# EAGLE design das.uhr (EAGLE 6.3)
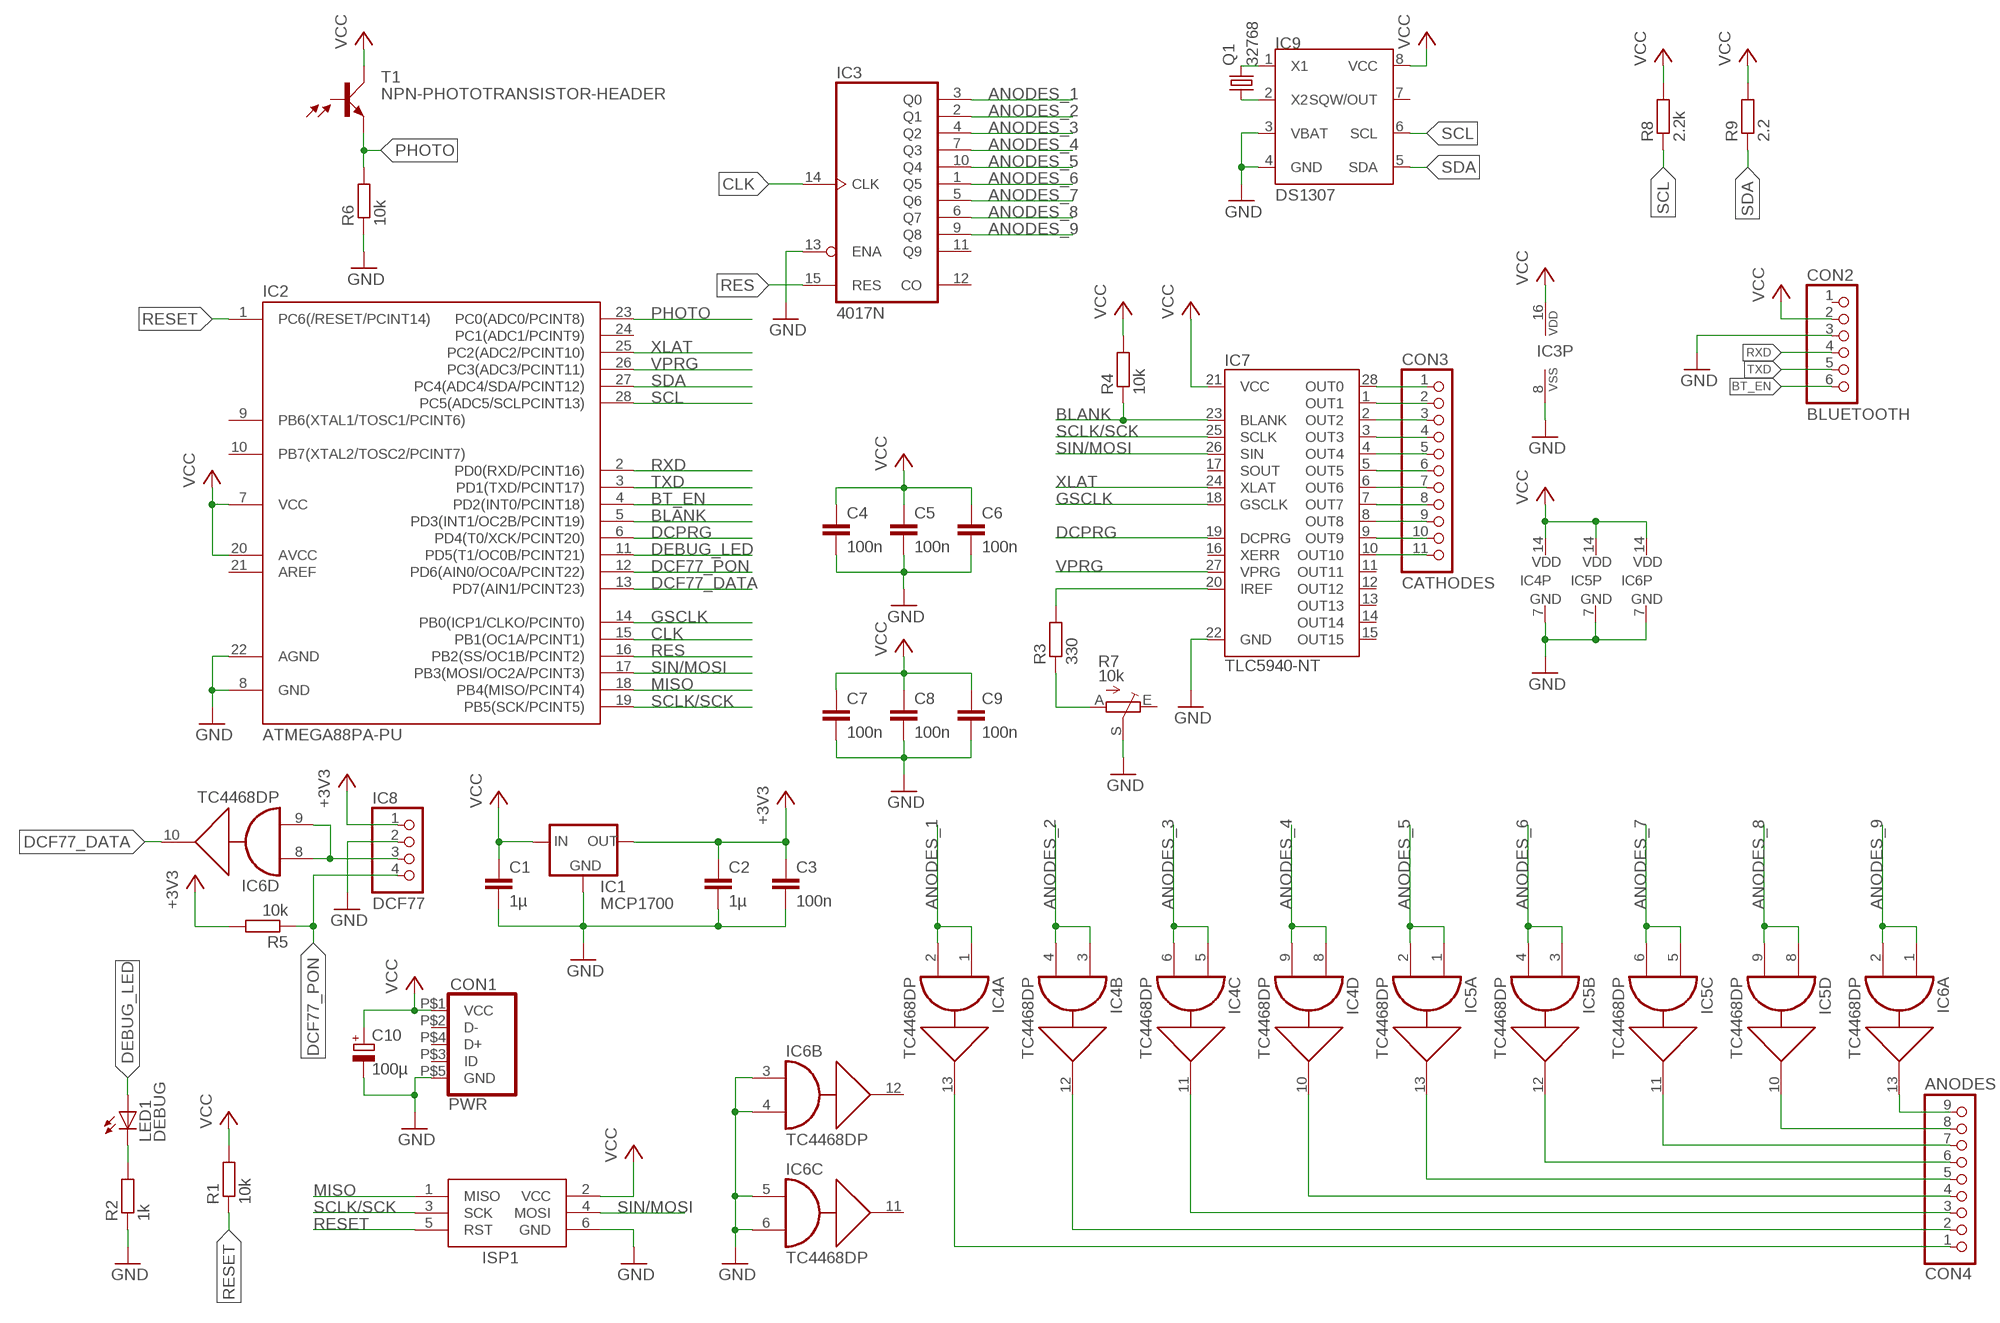
[diagram p0: schematic, sheet 1]

## Parts
C1  1µ  C050-024X044  [C050-024X044]
C2  1µ  C050-024X044  [C050-024X044]
C3  100n  C050-024X044  [C050-024X044]
C4  100n  C050-024X044  [C050-024X044]
C5  100n  C050-024X044  [C050-024X044]
C6  100n  C050-024X044  [C050-024X044]
C7  100n  C050-024X044  [C050-024X044]
C8  100n  C050-024X044  [C050-024X044]
C9  100n  C050-024X044  [C050-024X044]
C10  100µ  CPOL-EUE2.5-5  [E2,5-5]
CON1  PWR  USB-RECEPTABLE-HIROSE-ZX62-AB-5PA(11)  [HIROSE-ZX62-AB-5PA(11)]
CON2  BLUETOOTH  PINHD-1X6  [1X06]
CON3  CATHODES  PINHD-1X11  [1X11]
CON4  ANODES  PINHD-1X9  [1X09]
IC1  MCP1700  MCP1700INLINE  [TO92-INLINE]
IC2  ATMEGA88PA-PU  MEGA48/88/168-PU  [DIL28-3]
IC3  4017N  [DIL16]
IC4  TC4468DP  [DIL14]
IC5  TC4468DP  [DIL14]
IC6  TC4468DP  [DIL14]
IC7  TLC5940-NT  [DIL28-3]
IC8  DCF77  PINHD-1X4  [1X04]
IC9  DS1307  [DIL08]
ISP1  AVRISP-6  [AVRISP]
LED1  DEBUG  LED3MM  [LED3MM]
Q1  32768  CRYSTALTC26V  [TC26V]
R1  10k  R-EU_0207/7  [0207/7]
R2  1k  R-EU_0207/7  [0207/7]
R3  330  R-EU_0207/7  [0207/7]
R4  10k  R-EU_0207/7  [0207/7]
R5  10k  R-EU_0207/7  [0207/7]
R6  10k  R-EU_0207/7  [0207/7]
R7  10k  TRIM_EU-S63P  [S63P]
R8  2.2k  R-EU_0207/7  [0207/7]
R9  2.2  R-EU_0207/7  [0207/7]
T1  NPN-PHOTOTRANSISTOR-HEADER  [1X02-S]

## Nets
+3V3: C2.1 C3.1 IC1.3(OUT) IC8.1 R5.2
ANODES_1: IC3.3(Q0) IC4.1(A:A) IC4.2(A:B)
ANODES_2: IC3.2(Q1) IC4.3(B:A) IC4.4(B:B)
ANODES_3: IC3.4(Q2) IC4.5(C:A) IC4.6(C:B)
ANODES_4: IC3.7(Q3) IC4.8(D:A) IC4.9(D:B)
ANODES_5: IC3.10(Q4) IC5.1(A:A) IC5.2(A:B)
ANODES_6: IC3.1(Q5) IC5.3(B:A) IC5.4(B:B)
ANODES_7: IC3.5(Q6) IC5.5(C:A) IC5.6(C:B)
ANODES_8: IC3.6(Q7) IC5.8(D:A) IC5.9(D:B)
ANODES_9: IC3.9(Q8) IC6.1(A:A) IC6.2(A:B)
BLANK: IC2.5(PD3(INT1/OC2B/PCINT19)) IC7.23(BLANK) R4.1
BT_EN: CON2.6 IC2.4(PD2(INT0/PCINT18))
CLK: IC2.15(PB1(OC1A/PCINT1)) IC3.14(CLK)
DCF77_DATA: IC2.13(PD7(AIN1/PCINT23)) IC6.10(D:Y)
DCF77_PON: IC2.12(PD6(AIN0/OC0A/PCINT22)) IC8.4 R5.1
DCPRG: IC2.6(PD4(T0/XCK/PCINT20)) IC7.19(DCPRG)
DEBUG_LED: IC2.11(PD5(T1/OC0B/PCINT21)) LED1.A
GND: C1.2 C2.2 C3.2 C4.2 C5.2 C6.2 C7.2 C8.2 C9.2 C10.- CON1.P$5(GND) CON2.3 IC1.1(GND) IC2.8(GND) IC2.22(AGND) IC3.8(VSS) IC3.13(ENA) IC4.7(P:GND) IC5.7(P:GND) IC6.3(B:A) IC6.4(B:B) IC6.5(C:A) IC6.6(C:B) IC6.7(P:GND) IC7.22(GND) IC8.2 IC9.3(VBAT) IC9.4(GND) ISP1.6(GND) R2.1 R6.1 R7.S
GSCLK: IC2.14(PB0(ICP1/CLKO/PCINT0)) IC7.18(GSCLK)
MISO: IC2.18(PB4(MISO/PCINT4)) ISP1.1(MISO)
N$1: LED1.K(C) R2.2
N$3: CON3.1 IC7.28(OUT0)
N$4: CON3.2 IC7.1(OUT1)
N$5: CON3.3 IC7.2(OUT2)
N$6: CON3.4 IC7.3(OUT3)
N$7: CON3.5 IC7.4(OUT4)
N$8: CON3.6 IC7.5(OUT5)
N$9: CON3.7 IC7.6(OUT6)
N$10: CON3.8 IC7.7(OUT7)
N$11: CON3.9 IC7.8(OUT8)
N$13: CON3.10 IC7.9(OUT9)
N$14: CON3.11 IC7.10(OUT10)
N$15: IC7.20(IREF) R3.2
N$16: CON4.9 IC6.13(A:Y)
N$17: CON4.8 IC5.10(D:Y)
N$18: CON4.7 IC5.11(C:Y)
N$19: CON4.6 IC5.12(B:Y)
N$20: CON4.5 IC5.13(A:Y)
N$21: CON4.4 IC4.10(D:Y)
N$22: CON4.3 IC4.11(C:Y)
N$23: CON4.2 IC4.12(B:Y)
N$24: CON4.1 IC4.13(A:Y)
N$25: IC6.8(D:A) IC6.9(D:B) IC8.3
N$26: R3.1 R7.A
N$27: IC9.1(X1) Q1.2
N$28: IC9.2(X2) Q1.1
PHOTO: IC2.23(PC0(ADC0/PCINT8)) R6.2 T1.2(E)
RES: IC2.16(PB2(SS/OC1B/PCINT2)) IC3.15(RES)
RESET: IC2.1(PC6(/RESET/PCINT14)) ISP1.5(RST) R1.1
RXD: CON2.4 IC2.2(PD0(RXD/PCINT16))
SCL: IC2.28(PC5(ADC5/SCLPCINT13)) IC9.6(SCL) R8.1
SCLK/SCK: IC2.19(PB5(SCK/PCINT5)) IC7.25(SCLK) ISP1.3(SCK)
SDA: IC2.27(PC4(ADC4/SDA/PCINT12)) IC9.5(SDA) R9.1
SIN/MOSI: IC2.17(PB3(MOSI/OC2A/PCINT3)) IC7.26(SIN) ISP1.4(MOSI)
TXD: CON2.5 IC2.3(PD1(TXD/PCINT17))
VCC: C1.1 C4.1 C5.1 C6.1 C7.1 C8.1 C9.1 C10.+ CON1.P$1(VCC) CON2.2 IC1.2(IN) IC2.7(VCC) IC2.20(AVCC) IC3.16(VDD) IC4.14(P:VDD) IC5.14(P:VDD) IC6.14(P:VDD) IC7.21(VCC) IC9.8(VCC) ISP1.2(VCC) R1.2 R4.2 R8.2 R9.2 T1.1(C)
VPRG: IC2.26(PC3(ADC3/PCINT11)) IC7.27(VPRG)
XLAT: IC2.25(PC2(ADC2/PCINT10)) IC7.24(XLAT)
Unconnected: CON1.P$2(D-) CON1.P$3(ID) CON1.P$4(D+) CON2.1 IC2.9(PB6(XTAL1/TOSC1/PCINT6)) IC2.10(PB7(XTAL2/TOSC2/PCINT7)) IC2.21(AREF) IC2.24(PC1(ADC1/PCINT9)) IC3.11(Q9) IC3.12(CO) IC6.11(C:Y) IC6.12(B:Y) IC7.11(OUT11) IC7.12(OUT12) IC7.13(OUT13) IC7.14(OUT14) IC7.15(OUT15) IC7.16(XERR) IC7.17(SOUT) IC9.7(SQW/OUT) R7.E

## Library data of the parts
C1-C9 = daspilker:C: CAPACITOR
C10 = rcl:CPOL-EU: POLARIZED CAPACITOR, European symbol
CON1 = daspilker:USB-RECEPTABLE: USB Receptable
CON2 = pinhead:PINHD-1X6: PIN HEADER
CON3 = pinhead:PINHD-1X11: PIN HEADER
CON4 = pinhead:PINHD-1X9: PIN HEADER
IC1 = adafruit:MCP1700: VOLTAGE REGULATOR
IC2 = daspilker:MEGA48/88/168-PU
IC3 = 40xx:4017: COUNTER/DIVIDER
IC4-IC6 = microchip:TC4468: Logic-Input CMOS Quad Drivers Source: TC 4469-MOSFET-DRIVER.pdf; MF: MICROCHIP; MPN: TC4468CPD; OC_FARNELL: 1557406; OC_NEWARK: 54K2859
IC7 = daspilker:TLC5940: TI TLC5940 16-channel LED Driver with Dot Correction and Grayscale PWM Control The TLC5940 is a 16-channel, constant-current sink LED driver. Each channel has an individually adjustable 4096-step grayscale PWM brightness control and a 64-step, constant-current sink (dot correction). The dot correction adjusts the brightness variations between LED channels and other LED drivers. The dot correction data is stored in an integrated EEPROM. Both grayscale control and dot correction are accessible via a serial interface. A single external resistor sets the maximum current value of all 16 channels. Packages: 28-pin HTSSOP 32-pin 5x5mm QFN 28-pin DIP
IC8 = pinhead:PINHD-1X4: PIN HEADER
IC9 = daspilker:DS1307: I2C Serial RTC w/56 bytes battery backed RAM
ISP1 = adafruit:AVRISP: AVR ISP HEADER Standard 6 pin header for AVR programming
LED1 = led:LED: LED OSRAM: - CHIPLED LG R971, LG N971, LY N971, LG Q971, LY Q971, LO R971, LY R971 LH N974, LH R974 LS Q976, LO Q976, LY Q976 LO Q996 - Hyper CHIPLED LW Q18S LB Q993, LB Q99A, LB R99A - SideLED LS A670, LO A670, LY A670, LG A670, LP A670 LB A673, LV A673, LT A673, LW A673 LH A674 LY A675 LS A676, LA A676, LO A676, LY A676, LW A676 LS A679, LY A679, LG A679 - Hyper Micro SIDELED® LS Y876, LA Y876, LO Y876, LY Y876 LT Y87S - SmartLED LW L88C, LW L88S LB L89C, LB L89S, LG L890 LS L89K, LO L89K, LY L89K LS L896, LA L896, LO L896, LY L896 - TOPLED LS T670, LO T670, LY T670, LG T670, LP T670 LSG T670, LSP T670, LSY T670, LOP T670, LYG T670 LG T671, LOG T671, LSG T671 LB T673, LV T673, LT T673, LW T673 LH T674 LS T676, LA T676, LO T676, LY T676, LB T676, LH T676, LSB T676, LW T676 LB T67C, LV T67C, LT T67C, LS T67K, LO T67K, LY T67K, LW E67C LS E67B, LA E67B, LO E67B, LY E67B, LB E67C, LV E67C, LT E67C LW T67C LS T679, LY T679, LG T679 LS T770, LO T770, LY T770, LG T770, LP T770 LB T773, LV T773, LT T773, LW T773 LH T774 LS E675, LA E675, LY E675, LS T675 LS T776, LA T776, LO T776, LY T776, LB T776 LHGB T686 LT T68C, LB T68C - Hyper Mini TOPLED® LB M676 - Mini TOPLED Santana® LG M470 LS M47K, LO M47K, LY M47K Source: http://www.osram.convergy.de LUXEON: - LUMILED® LXK2-PW12-R00, LXK2-PW12-S00, LXK2-PW14-U00, LXK2-PW14-V00 LXK2-PM12-R00, LXK2-PM12-S00, LXK2-PM14-U00 LXK2-PE12-Q00, LXK2-PE12-R00, LXK2-PE12-S00, LXK2-PE14-T00, LXK2-PE14-U00 LXK2-PB12-K00, LXK2-PB12-L00, LXK2-PB12-M00, LXK2-PB14-N00, LXK2-PB14-P00, LXK2-PB14-Q00 LXK2-PR12-L00, LXK2-PR12-M00, LXK2-PR14-Q00, LXK2-PR14-R00 LXK2-PD12-Q00, LXK2-PD12-R00, LXK2-PD12-S00 LXK2-PH12-R00, LXK2-PH12-S00 LXK2-PL12-P00, LXK2-PL12-Q00, LXK2-PL12-R00 Source: www.luxeon.com KINGBRIGHT: KA-3528ASYC Source: www.kingbright.com
Q1 = crystal:CRYSTAL: CRYSTAL; OC_FARNELL: unknown; OC_NEWARK: unknown
R1-R6 R8 R9 = rcl:R-EU_: RESISTOR, European symbol
R7 = pot:TRIM_EU-: POTENTIOMETER
T1 = daspilker:NPN-PHOTOTRANSISTOR: NPN phototransistor

## Board
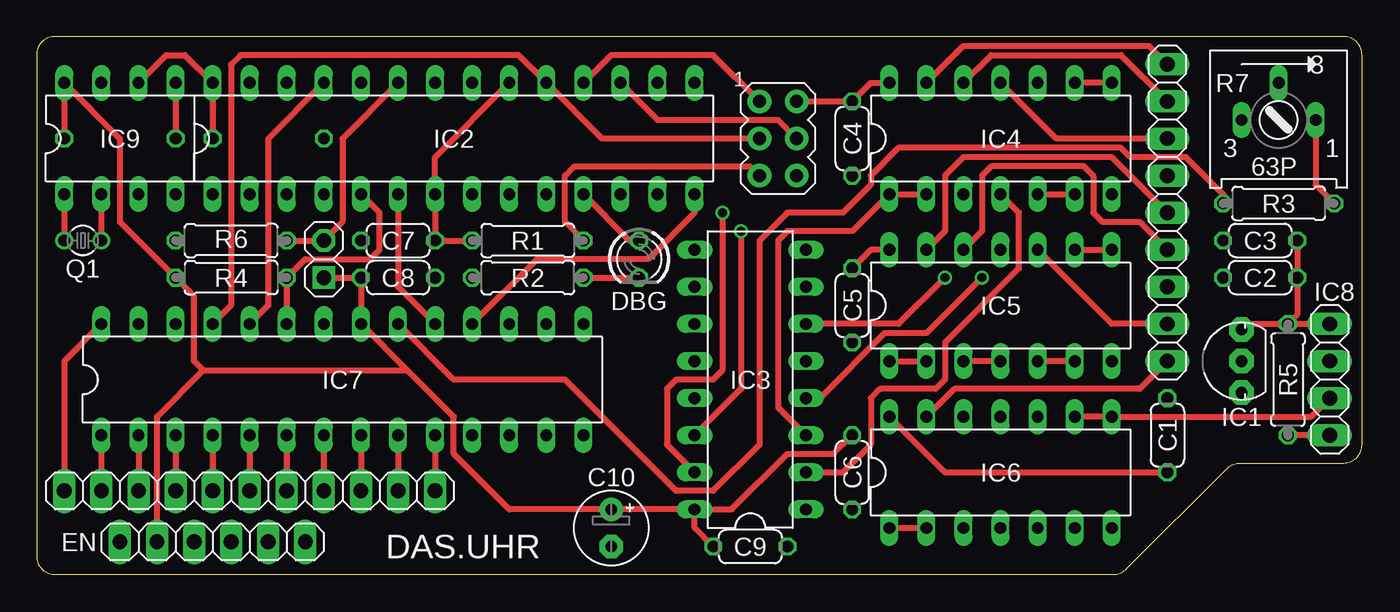
[diagram p1: board, top side]
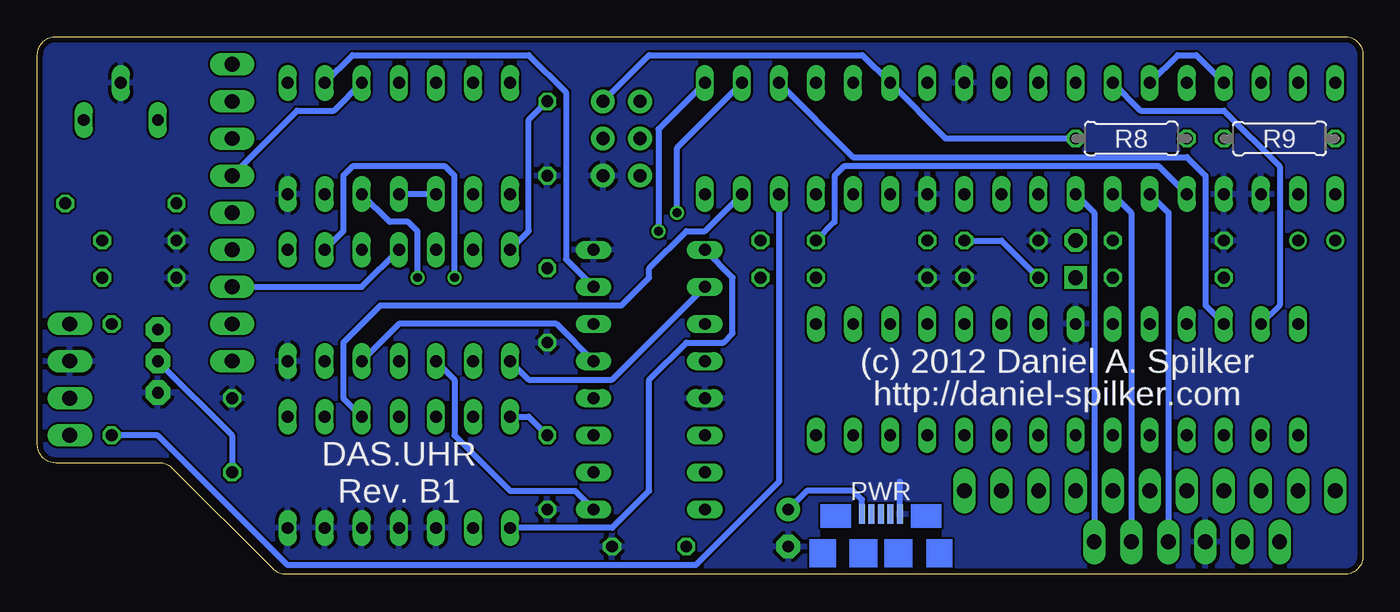
[diagram p2: board, bottom side, seen from below]

Size 90.81 x 36.83 mm. Coordinates in mm from the lower left corner, seen from the top.
Outline: 1.27,0 73.77,0 arc45 74.67,0.37 81.54,7.25 arc-45 82.44,7.62 89.53,7.62 arc90 90.81,8.89 90.81,35.56 arc90 89.53,36.83 1.27,36.83 arc90 0,35.56 0,1.27 arc90 1.27,0
Copper layers (1*16): Top 0.0356mm / dielectric 1.5011mm / Bottom 0.0356mm
Design rules "LaenPCBOrder": minimum track width 6mil, minimum drill 13mil, track to track 6mil, track to pad 6mil, pad to pad 6mil, via to via 6mil, smd to smd 6mil, copper to edge 15mil, drill to drill 6mil, minimum pad ring 7mil, minimum via ring 7mil, stop-mask expansion 4mil, vias tented up to drill 0mil, thermal gap 10mil

### Footprints (pad centres in the part's own frame; a part is rotated, then mirrored left to right if it is on the bottom)
C050-024X044 = drill 0.813 octagon: 1 -2.54,0; 2 2.54,0
E2,5-5 = drill 0.813 pad 1.6: + -1.27,0 | drill 0.813 pad 1.6 octagon: - 1.27,0
HIROSE-ZX62-AB-5PA(11) = smd 0.4 x 1.35 bottom: P$1 1.3,4.125; P$2 0.65,4.125; P$3 0,4.125; P$4 -0.65,4.125; P$5 -1.3,4.125
1X06 = drill 1.016 long: 1 -6.35,0; 2 -3.81,0; 3 -1.27,0; 4 1.27,0; 5 3.81,0; 6 6.35,0
1X11 = drill 1.016 long: 1 -12.7,0; 2 -10.16,0; 3 -7.62,0; 4 -5.08,0; 5 -2.54,0; 6 0,0; 7 2.54,0; 8 5.08,0; 9 7.62,0; 10 10.16,0; 11 12.7,0
1X09 = drill 1.016 long: 1 -10.16,0; 2 -7.62,0; 3 -5.08,0; 4 -2.54,0; 5 0,0; 6 2.54,0; 7 5.08,0; 8 7.62,0; 9 10.16,0
TO92-INLINE = drill 0.813 pad 1.676 octagon: 1 -2.159,0; 2 0,0; 3 2.159,0
DIL28-3 = drill 0.813 long: 1 -16.51,-3.81; 2 -13.97,-3.81; 3 -11.43,-3.81; 4 -8.89,-3.81; 5 -6.35,-3.81; 6 -3.81,-3.81; 7 -1.27,-3.81; 8 1.27,-3.81; 9 3.81,-3.81; 10 6.35,-3.81; 11 8.89,-3.81; 12 11.43,-3.81; 13 13.97,-3.81; 14 16.51,-3.81; 15 16.51,3.81; 16 13.97,3.81; 17 11.43,3.81; 18 8.89,3.81; 19 6.35,3.81; 20 3.81,3.81; 21 1.27,3.81; 22 -1.27,3.81; 23 -3.81,3.81; 24 -6.35,3.81; 25 -8.89,3.81; 26 -11.43,3.81; 27 -13.97,3.81; 28 -16.51,3.81
DIL16 = drill 0.813 long: 1 -8.89,-3.81; 2 -6.35,-3.81; 3 -3.81,-3.81; 4 -1.27,-3.81; 5 1.27,-3.81; 6 3.81,-3.81; 7 6.35,-3.81; 8 8.89,-3.81; 9 8.89,3.81; 10 6.35,3.81; 11 3.81,3.81; 12 1.27,3.81; 13 -1.27,3.81; 14 -3.81,3.81; 15 -6.35,3.81; 16 -8.89,3.81
DIL14 = drill 0.813 long: 1 -7.62,-3.81; 2 -5.08,-3.81; 3 -2.54,-3.81; 4 0,-3.81; 5 2.54,-3.81; 6 5.08,-3.81; 7 7.62,-3.81; 8 7.62,3.81; 9 5.08,3.81; 10 2.54,3.81; 11 0,3.81; 12 -2.54,3.81; 13 -5.08,3.81; 14 -7.62,3.81
1X04 = drill 1.016 long: 1 -3.81,0; 2 -1.27,0; 3 1.27,0; 4 3.81,0
DIL08 = drill 0.813 long: 1 -3.81,-3.81; 2 -1.27,-3.81; 3 1.27,-3.81; 4 3.81,-3.81; 5 3.81,3.81; 6 1.27,3.81; 7 -1.27,3.81; 8 -3.81,3.81
AVRISP = drill 0.9 pad 1.626: 1 -1.27,2.54; 2 1.27,2.54; 3 -1.27,0; 4 1.27,0; 5 -1.27,-2.54; 6 1.27,-2.54
LED3MM = drill 0.813 octagon: A -1.27,0; K 1.27,0
TC26V = drill 0.813: 1 -1.27,0; 2 1.27,0
0207/7 = drill 0.813 octagon: 1 -3.81,0; 2 3.81,0
S63P = drill 0.813 long: A 2.54,0; E -2.54,0; S 0,2.54
1X02-S = drill 1.016 square: 1 -1.27,0 | drill 1.016 octagon: 2 1.27,0

### Placement (x,y rotation side)
C1  77.47,9.53 90 top
C2  83.82,20.32 180 top
C3  83.82,22.86 180 top
C4  55.88,29.84 270 top
C5  55.88,18.41 270 top
C6  55.88,6.99 270 top
C7  24.77,22.86 180 top
C8  24.77,20.32 0 top
C9  48.9,1.91 0 top
C10  39.37,3.17 270 top
CON1  33.02,0 0 top
CON2  12.06,2.22 0 top
CON3  14.61,5.71 0 top
CON4  77.47,24.77 270 top
IC1  82.55,14.61 90 top
IC2  28.57,29.84 0 top
IC3  48.9,13.34 90 top
IC4  66.04,29.84 0 top
IC5  66.04,18.41 0 top
IC6  66.04,6.99 0 top
IC7  20.95,13.34 0 top
IC8  88.58,13.34 270 top
IC9  5.71,29.84 0 top
ISP1  50.8,29.84 0 top
LED1  41.27,21.59 270 top
Q1  3.17,22.86 180 top
R1  33.66,22.86 180 top
R2  33.66,20.32 0 top
R3  85.09,25.4 180 top
R4  13.34,20.32 180 top
R5  85.72,13.34 90 top
R6  13.34,22.86 0 top
R7  85.09,31.11 0 top
R8  15.88,29.84 180 bottom
R9  5.71,29.84 0 bottom
T1  19.68,21.59 90 top

### Tracks (layer width: path | path; a pad name or v marks a point on that pad's centre or on a via)
+3V3
  Top 0.406: R5.2 IC8.1 | C3.1 C2.1 86.36,17.78 R5.2 | IC1.3 82.93,17.14 R5.2
ANODES_1
  Top 0.406: IC4.2 IC4.1 55.88,23.5 51.44,23.5 50.8,22.86 50.8,11.43 IC3.3
ANODES_2
  Top 0.406: IC3.2 55.24,6.99 57.15,8.89 57.15,12.06 57.78,12.7 61.59,12.7 62.23,13.34 62.23,15.88 67.31,20.95 67.31,24.77 IC4.4
  Bottom 0.406: IC4.3 IC4.4
ANODES_3  (via drill 0.6)
  Top 0.406: IC4.5 IC4.6 | v64.77,20.32 60.96,16.51 58.1,16.51 53.66,12.06 IC3.4
  Bottom 0.406: v64.77,20.32 64.77,23.5 65.41,24.13 66.67,24.13 IC4.5
ANODES_4
  Top 0.406: IC4.8 IC4.9
  Bottom 0.406: IC4.9 69.22,35.56 57.15,35.56 54.61,33.02 54.61,21.59 IC3.7
ANODES_5
  Top 0.406: IC5.1 IC5.2
  Bottom 0.406: IC5.1 57.15,13.34 51.44,13.34 IC3.10
ANODES_6
  Top 0.406: IC5.4 IC5.3
  Bottom 0.406: IC3.1 53.98,5.71 58.42,5.71 62.23,9.53 62.23,13.34 IC5.3
ANODES_7
  Top 0.406: IC5.6 IC5.5
  Bottom 0.406: IC3.5 55.24,17.14 66.04,17.14 IC5.5
ANODES_8  (via drill 0.6)
  Top 0.406: IC5.9 IC5.8 | v62.23,20.32 59.05,17.14 IC3.6
  Bottom 0.406: v62.23,20.32 62.23,27.3 62.87,27.94 69.22,27.94 69.85,27.3 69.85,23.5 IC5.9
ANODES_9
  Top 0.406: IC6.1 IC6.2
  Bottom 0.406: IC3.9 43.18,20.32 43.18,16.51 43.81,15.88 46.35,15.88 48.9,13.34 48.9,5.71 51.44,3.17 IC6.1
BLANK
  Top 0.406: IC2.5 23.5,24.77 23.5,22.23 22.86,21.59 18.41,21.59 R4.1 IC7.23
BT_EN
  Bottom 0.406: IC2.4 18.41,24.77 CON2.6
CLK  (via drill 0.6)
  Top 0.406: v48.26,23.5 48.26,12.7 IC3.14
  Bottom 0.406: IC2.15 48.26,30.48 v48.26,23.5
DCF77_DATA
  Bottom 0.406: IC2.13 45.09,23.5 46.35,23.5 48.9,20.95 48.9,20.32 50.8,18.41 67.31,18.41 69.85,15.88 69.85,12.06 IC6.10
DCF77_PON
  Top 0.406: IC8.4 R5.1
  Bottom 0.406: R5.1 82.55,9.53 73.66,0.64 45.72,0.64 40.01,6.35 IC2.12
DCPRG
  Top 0.406: IC2.6 24.77,19.68 IC7.19
DEBUG_LED
  Top 0.406: IC2.11 40.64,22.86 LED1.A
GND
  Bottom 0.406: CON1.P$5 31.72,6.32 31.75,6.35
  pour Bottom: 90.81,36.2 90.81,6.99 81.28,6.99 73.66,0 0.64,0 arc-90 0,0.64 0,36.2 arc-90 0.64,36.83 89.53,36.83 arc-90
GSCLK
  Top 0.406: IC7.18 34.29,21.59 41.91,21.59 45.09,24.77 IC2.14
MISO
  Top 0.406: ISP1.1 46.35,35.56 39.37,35.56 IC2.18
N$1
  Top 0.406: R2.2 LED1.K
N$3
  Top 0.406: IC7.28 1.91,14.61 CON3.1
N$4
  Top 0.406: IC7.1 CON3.2
N$5
  Top 0.406: IC7.2 CON3.3
N$6
  Top 0.406: IC7.3 CON3.4
N$7
  Top 0.406: IC7.4 CON3.5
N$8
  Top 0.406: IC7.5 CON3.6
N$9
  Top 0.406: IC7.6 CON3.7
N$10
  Top 0.406: IC7.7 CON3.8
N$11
  Top 0.406: IC7.8 CON3.9
N$13
  Top 0.406: IC7.9 CON3.10
N$14
  Top 0.406: IC7.10 CON3.11
N$15
  Top 0.406: R3.2 81.28,26.04 78.74,28.57 74.93,28.57 74.3,29.21 59.05,29.21 57.15,27.3 57.15,26.67 55.24,24.77 51.44,24.77 49.53,22.86 49.53,8.89 46.35,5.71 43.81,5.71 36.2,13.34 28.57,13.34 IC7.20
N$16
  Top 0.406: CON4.9 75.56,12.7 62.87,12.7 IC6.13
N$17
  Top 0.406: CON4.8 73.66,17.14 IC5.10
N$18
  Bottom 0.406: CON4.7 68.58,19.68 IC5.11
N$19
  Top 0.406: IC5.12 64.77,23.5 64.77,27.3 65.41,27.94 71.75,27.94 72.39,27.3 72.39,24.77 73.03,24.13 75.56,24.13 CON4.6
N$20
  Top 0.406: CON4.5 73.66,28.57 63.5,28.57 62.23,27.3 62.23,23.5 IC5.13
N$21
  Bottom 0.406: CON4.4 73.03,31.75 70.48,31.75 IC4.10
N$22
  Top 0.406: CON4.3 69.85,29.84 IC4.11
N$23
  Top 0.406: IC4.12 65.41,35.56 74.3,35.56 CON4.2
N$24
  Top 0.406: IC4.13 63.5,36.2 76.2,36.2 CON4.1
N$25
  Top 0.406: IC6.9 IC6.8 87.31,10.79 IC8.3
N$26
  Top 0.406: R7.A 87.63,26.67 R3.1
N$27
  Top 0.406: IC9.1 Q1.2
N$28
  Top 0.406: IC9.2 Q1.1
PHOTO
  Top 0.406: IC2.23 20.95,29.84 20.95,24.13 T1.2 R6.2
RES  (via drill 0.6)
  Top 0.406: v46.99,24.77 46.99,13.97 46.35,13.34 43.81,13.34 43.18,12.7 43.18,8.89 IC3.15
  Bottom 0.406: v46.99,24.77 46.99,29.21 IC2.16
RESET
  Top 0.406: R1.1 36.2,24.13 36.2,27.3 36.83,27.94 48.9,27.94 ISP1.5
  Bottom 0.406: IC2.1 13.97,27.94 35.56,27.94 36.2,27.3 36.2,24.13 R1.1
RXD
  Bottom 0.406: IC2.2 13.34,24.77 CON2.4
SCL
  Top 0.406: IC9.6 8.89,35.56 10.16,35.56 IC2.28 R8.1
SCLK/SCK
  Top 0.406: ISP1.3 38.73,29.84 IC2.19 33.02,35.56 13.97,35.56 13.34,34.92 13.34,18.41 IC7.25
SDA
  Top 0.406: IC9.5 R9.1
  Bottom 0.406: IC2.27 12.7,35.56 11.43,35.56 IC9.5
SIN/MOSI
  Top 0.406: ISP1.4 50.8,31.11 42.55,31.11 IC2.17
  Bottom 0.406: IC7.26 10.79,18.41 10.79,27.3 12.06,28.57 34.92,28.57 IC2.17
TXD
  Bottom 0.406: IC2.3 15.88,24.77 CON2.5
VCC
  Top 0.406: IC6.14 62.23,6.99 C1.1 | IC2.20 27.3,28.57 IC2.7 C7.1 R1.2 | IC3.16 47.62,4.45 51.44,8.26 54.61,8.26 C6.1 | ISP1.2 C4.1 57.15,33.66 IC4.14 | T1.1 C8.1 IC7.21 25.4,13.97 | CON2.2 8.26,10.79 11.43,13.97 | 11.43,13.97 25.4,13.97 | 11.43,13.97 10.79,14.61 10.79,19.05 R4.2 5.71,24.13 5.71,29.84 IC9.8 R9.2 | 25.4,13.97 28.57,10.79 28.57,8.26 32.38,4.45 C10.+ IC3.16 | IC5.14 57.15,22.23 C5.1 | C9.1 45.09,3.17 IC3.16
  Bottom 0.406: IC5.14 57.15,23.5 57.15,31.11 C4.1 | ISP1.2 48.9,35.56 34.29,35.56 IC2.20 28.57,29.84 R8.2 | C7.1 24.77,22.86 C8.1 | IC6.14 57.15,10.79 C6.1 | CON1.P$1 34.32,5.11 34.92,5.71 38.1,5.71 C10.+ | IC1.2 77.47,9.53 C1.1
VPRG
  Bottom 0.406: IC2.26 15.24,31.75 9.53,31.75 5.71,27.94 5.71,18.41 IC7.27
XLAT
  Top 0.406: IC7.24 15.88,18.41 15.88,29.84 IC2.25

### Text on the board
tNames: DBG | EN | DAS.UHR
bNames: (c) 2012 Daniel A. Spilker | http://daniel-spilker.com | DAS.UHR | Rev. B1